# EAGLE schematic ADS1298-breakout (EAGLE 6.5.0)
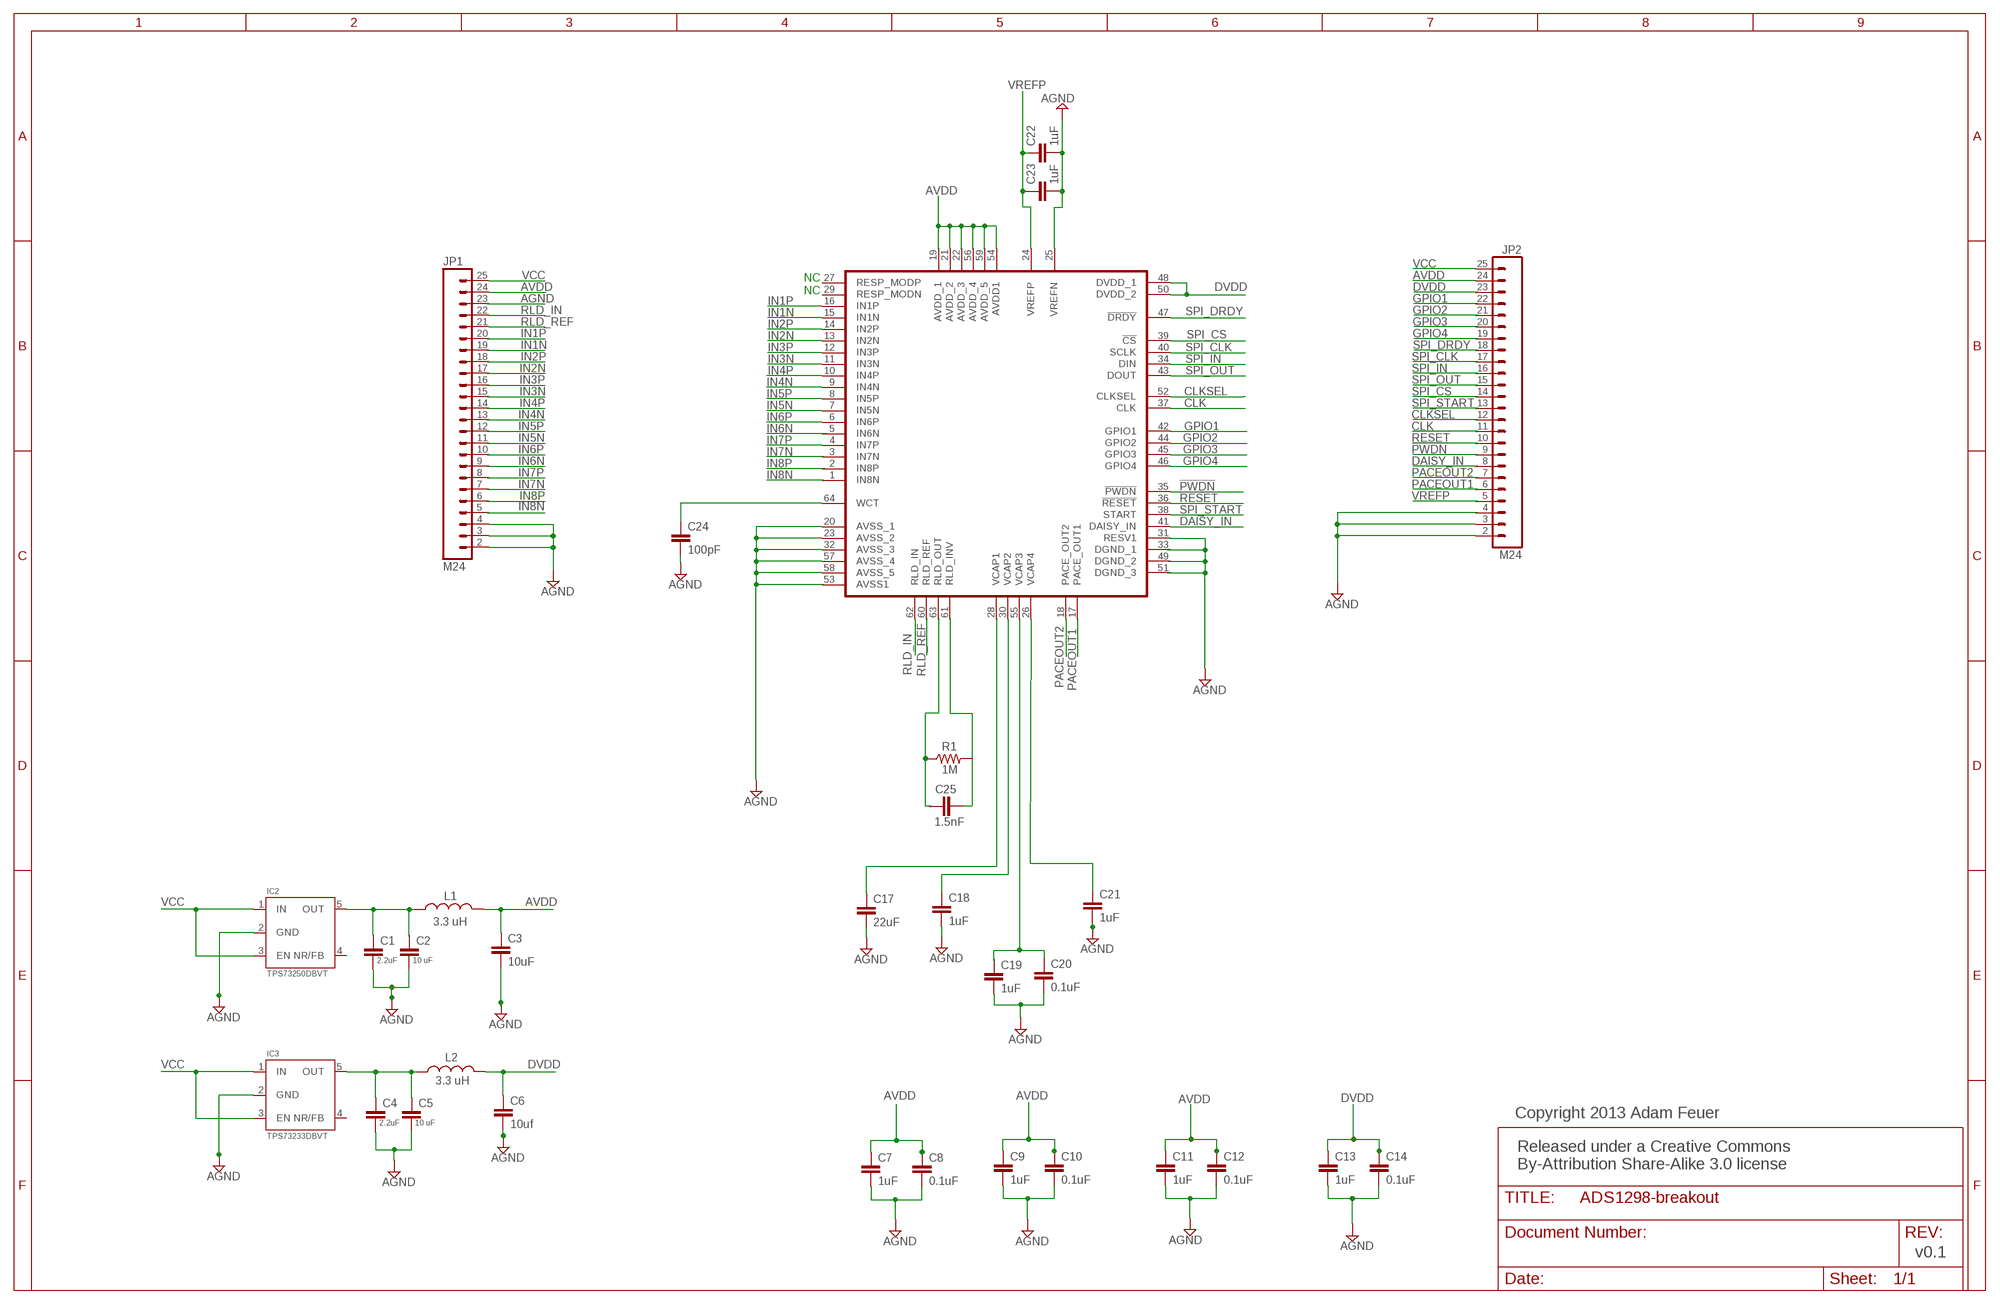
[diagram p0: schematic, sheet 1]

## Parts
C1  2.2uF  CAP0603-CAP  [0603-CAP]
C2  10 uF  CAP0603-CAP  [0603-CAP]
C3  10uF  CAP0603-CAP  [0603-CAP]
C4  2.2uF  CAP0603-CAP  [0603-CAP]
C5  10 uF  CAP0603-CAP  [0603-CAP]
C6  10uf  CAP0603-CAP  [0603-CAP]
C7  1uF  CAP0603-CAP  [0603-CAP]
C8  0.1uF  CAP0603-CAP  [0603-CAP]
C9  1uF  CAP0603-CAP  [0603-CAP]
C10  0.1uF  CAP0603-CAP  [0603-CAP]
C11  1uF  CAP0603-CAP  [0603-CAP]
C12  0.1uF  CAP0603-CAP  [0603-CAP]
C13  1uF  CAP0603-CAP  [0603-CAP]
C14  0.1uF  CAP0603-CAP  [0603-CAP]
C17  22uF  CAP0603-CAP  [0603-CAP]
C18  1uF  CAP0603-CAP  [0603-CAP]
C19  1uF  CAP0603-CAP  [0603-CAP]
C20  0.1uF  CAP0603-CAP  [0603-CAP]
C21  1uF  CAP0603-CAP  [0603-CAP]
C22  1uF  CAP0603-CAP  [0603-CAP]
C23  1uF  CAP0603-CAP  [0603-CAP]
C24  100pF  CAP0603-CAP  [0603-CAP]
C25  1.5nF  CAP0603-CAP  [0603-CAP]
IC1  ADS1298*PAG*  [TQFP64]
IC2  TPS73250DBVT  TPS732XXDBV  [SOT23-5]
IC3  TPS73233DBVT  TPS732XXDBV  [SOT23-5]
JP1  M24  [1X24]
JP2  M24  [1X24]
L1  3.3 uH  INDUCTOR0603  [0603]
L2  3.3 uH  INDUCTOR0603  [0603]
R1  1M  RESISTOR0603-RES  [0603-RES]

## Nets
!PWDN: IC1.35(!PWDN) JP2.9
!RESET: IC1.36(!RESET) JP2.10
AGND: C1.2 C2.2 C3.2 C4.2 C5.2 C6.2 C7.2 C8.2 C9.2 C10.2 C11.2 C12.2 C13.2 C14.2 C17.2 C18.2 C19.2 C20.2 C21.2 C22.2 C23.2 C24.2 IC1.20(AVSS_1) IC1.23(AVSS_2) IC1.25(VREFN) IC1.31(RESV1) IC1.32(AVSS_3) IC1.33(DGND_1) IC1.49(DGND_2) IC1.51(DGND_3) IC1.53(AVSS1) IC1.57(AVSS_4) IC1.58(AVSS_5) IC2.2(GND) IC3.2(GND) JP1.2 JP1.3 JP1.4 JP1.23 JP2.2 JP2.3 JP2.4
AVDD: C3.1 C7.1 C8.1 C9.1 C10.1 C11.1 C12.1 IC1.19(AVDD_1) IC1.21(AVDD_2) IC1.22(AVDD_3) IC1.54(AVDD1) IC1.56(AVDD_4) IC1.59(AVDD_5) JP1.24 JP2.24 L1.2
CLK: IC1.37(CLK) JP2.11
CLKSEL: IC1.52(CLKSEL) JP2.12
DAISY_IN: IC1.41(DAISY_IN) JP2.8
DVDD: C6.1 C13.1 C14.1 IC1.48(DVDD_1) IC1.50(DVDD_2) JP2.23 L2.2
GPIO1: IC1.42(GPIO1) JP2.22
GPIO2: IC1.44(GPIO2) JP2.21
GPIO3: IC1.45(GPIO3) JP2.20
GPIO4: IC1.46(GPIO4) JP2.19
IN1N: IC1.15(IN1N) JP1.19
IN1P: IC1.16(IN1P) JP1.20
IN2N: IC1.13(IN2N) JP1.17
IN2P: IC1.14(IN2P) JP1.18
IN3N: IC1.11(IN3N) JP1.15
IN3P: IC1.12(IN3P) JP1.16
IN4N: IC1.9(IN4N) JP1.13
IN4P: IC1.10(IN4P) JP1.14
IN5N: IC1.7(IN5N) JP1.11
IN5P: IC1.8(IN5P) JP1.12
IN6N: IC1.5(IN6N) JP1.9
IN6P: IC1.6(IN6P) JP1.10
IN7N: IC1.3(IN7N) JP1.7
IN7P: IC1.4(IN7P) JP1.8
IN8N: IC1.1(IN8N) JP1.5
IN8P: IC1.2(IN8P) JP1.6
N$1: C4.1 C5.1 IC3.5(OUT) L2.1
N$2: C1.1 C2.1 IC2.5(OUT) L1.1
N$3: C17.1 IC1.28(VCAP1)
N$4: C18.1 IC1.30(VCAP2)
N$5: C19.1 C20.1 IC1.55(VCAP3)
N$7: C24.1 IC1.64(WCT)
N$8: C21.1 IC1.26(VCAP4)
PACEOUT1: IC1.17(PACE_OUT1) JP2.6
PACEOUT2: IC1.18(PACE_OUT2) JP2.7
RLD_IN: IC1.62(RLD_IN) JP1.22
RLD_INV: C25.2 IC1.61(RLD_INV) R1.2
RLD_OUT: C25.1 IC1.63(RLD_OUT) R1.1
RLD_REF: IC1.60(RLD_REF) JP1.21
SPI_CLK: IC1.40(SCLK) JP2.17
SPI_CS: IC1.39(!CS) JP2.14
SPI_DRDY: IC1.47(!DRDY) JP2.18
SPI_IN: IC1.34(DIN) JP2.16
SPI_OUT: IC1.43(DOUT) JP2.15
SPI_START: IC1.38(START) JP2.13
VCC: IC2.1(IN) IC2.3(EN) IC3.1(IN) IC3.3(EN) JP1.25 JP2.25
VREFP: C22.1 C23.1 IC1.24(VREFP) JP2.5
Unconnected: IC1.27(RESP_MODP) IC1.29(RESP_MODN) IC2.4(NR/FB) IC3.4(NR/FB)

## Notes on the sheet
- NC
- NC
- Copyright 2013 Adam Feuer
- Released under a Creative Commons 
  By-Attribution Share-Alike 3.0 license
- v0.1

## Library data of the parts
C1-C14 C17-C25 = SparkFun-Passives:CAP: Capacitor Standard 0603 ceramic capacitor, and 0.1" leaded capacitor.
IC1 = burr-brown-5a:ADS1298: 8-Channel, 24-Bit Analog-To-Digital Converter With Integrated ECG Front End. Warning: PAG variant (TQFP package) does not have Respiration Module - pins 27 and 29 must stay unconnected! Drawn 23.07.2011 by Tomasz Boleslaw CEDRO (http://www.tomek.cedro.info).
IC2 IC3 = TPS32xx:TPS732XX: Cap-Free, NMOS, 250mA Low Dropout Regulator with Reverse Current Protection
JP1 JP2 = SparkFun-Connectors:M24: 1x24 .1" header
L1 L2 = SparkFun-Passives:INDUCTOR: Inductors Basic Inductor/Choke - 0603 and 1206. Footprints are not proven and vary greatly between part numbers. SRN6045- 33uH, 20% 1.4A
R1 = SparkFun-Passives:RESISTOR: Resistor Basic schematic elements and footprints for 0603, 1206, and PTH resistors.